# Altium schematic sheet Current-LoadSwitches 3V3.SchDoc
size A
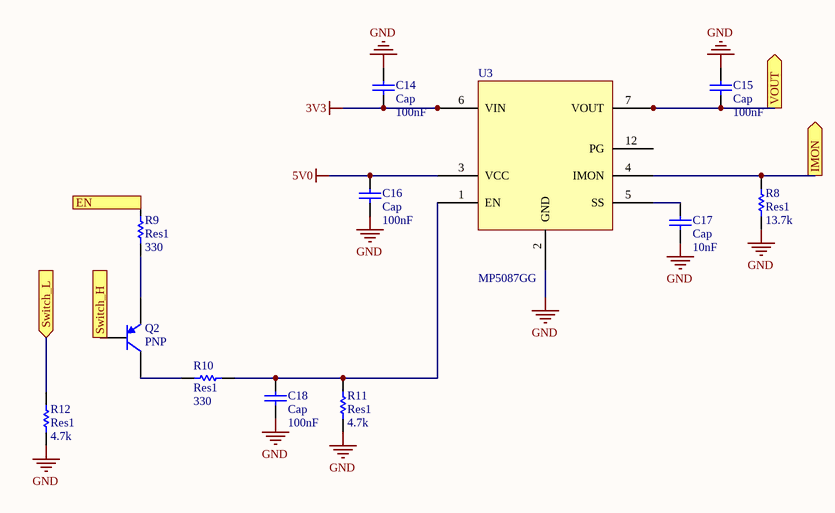
[diagram p0: Current-LoadSwitches 3V3.SchDoc]

## Parts
C14  Cap  value 100nF  [1608[0603]]
C15  Cap  value 100nF  [1608[0603]]
C16  Cap  value 100nF  [1608[0603]]
C17  Cap  value 10nF  [1608[0603]]
C18  Cap  value 100nF  [1608[0603]]
Q2  PNP  [SOT-23B_N]
R8  Res1  value 13.7k  [1608[0603]]
R9  Res1  value 330  [1608[0603]]
R10  Res1  value 330  [1608[0603]]
R11  Res1  value 4.7k  [1608[0603]]
R12  Res1  value 4.7k  [1608[0603]]
U3  MP5087GG  [MP5087GG-Z]

## Ports
EN (in), IMON (out), Switch_H (out), Switch_L (in), VOUT (out)

## Nets
3V3: C14.1 U3.6(VIN) U3.11(VOUT)
5V0: C16.2 U3.3(VCC)
GND: C14.2 C15.2 C16.1 C17.1 C18.1 R8.1 R11.1 R12.1 U3.2(GND)
EN: R9.2 ; port EN
IMON: R8.2 U3.4(IMON) ; port IMON
Switch_H: Q2.2(B) ; port Switch_H
Switch_L: R12.2 ; port Switch_L
VOUT: C15.1 U3.7(VOUT) U3.8(VOUT) U3.9(VOUT) U3.10(VOUT) ; port VOUT
NetC17_2: C17.2 U3.5(SS)
NetC18_2: C18.2 R10.2 R11.2 U3.1(EN)
NetQ2_1: Q2.1(C) R10.1
NetQ2_3: Q2.3(E) R9.1

Not connected (* = marked no-connect by the designer): U3 12(PG)

## Library data of the parts
C14-C18 = Cap: Capacitor; Published: 8-Jun-2000; LatestRevisionDate: 17-Jul-2002; LatestRevisionNote: Re-released for DXP Platform.; PackageReference: RAD-0.3; Publisher: Altium Limited; PackageDescription: Radial Cap, Thru-Hole; 2 Leads; 0.3 in Pin Spacing
Q2 = PNP: PNP Bipolar Transistor; Published: 8-Jun-2000; LatestRevisionDate: 29-May-2009; LatestRevisionNote: IPC-7351 Footprint Added.; PackageVersion: Aug-1999; PackageReference: SOT-23B; Publisher: Altium Limited; PackageDescription: 3-Pin SOT-23 Package 0.95 mm Pitch, 2.4 mm Lead Span
R8-R12 = Res1: Resistor; Published: 8-Jun-2000; LatestRevisionDate: 17-Jul-2002; LatestRevisionNote: Re-released for DXP Platform.; PackageReference: AXIAL-0.3; Publisher: Altium Limited; PackageDescription: Axial Device, Thru-Hole; 2 Leads; 0.3 in Pin Spacing
U3 = Component_1